# Altium schematic sheet NOR Flash.SchDoc
size A; SheetNumber: 4; SheetTotal: 9
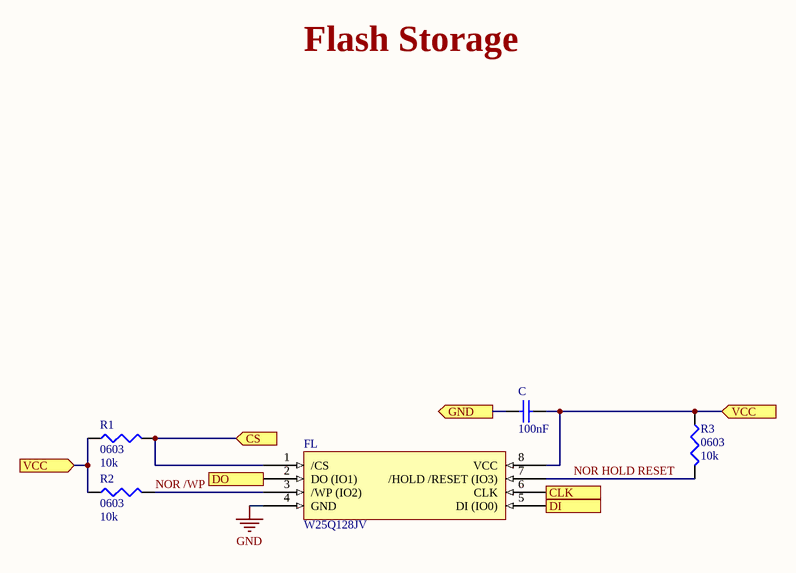
[diagram p0: NOR Flash.SchDoc]

## Parts
C  100nF  [CAPC1608X95X40ML15T15]
FL  omponent_1  [SOIC-8 - duplicate]  (value not drawn)
R1  0603  value 10k  [J1-0603]
R2  0603  value 10k  [J1-0603]
R3  0603  value 10k  [J1-0603]

## Ports
CLK (in), CS (in), DI (in), DO (out), GND (out), VCC (in)

## Nets
GND: FL.4(GND)
CLK: FL.6(CLK) ; port CLK
CS: FL.1(/CS) R1.2 ; port CS
DI: FL.5(DI_(IO0)) ; port DI
DO: FL.2(DO_(IO1)) ; port DO
GND: C.2 ; port GND  [a separate net that carries the same name]
NOR /WP: FL.3(/WP_(IO2)) R2.2
NOR HOLD RESET: FL.7(/HOLD_/RESET_(IO3)) R3.2
VCC: C.1 FL.8(VCC) R1.1 R2.1 R3.1 ; port VCC

## Notes on the sheet
- Flash Storage
- (in symbol Component_1) W25Q128JV

## Library data of the parts
C = CMP-2006-01550-1: Manufacturer: Vitramon; Part Number: VJ0603Y104KXQCW1BC
FL = Component_1
R1-R3 = Res3: Resistor; Published: 8-Jun-2000; LatestRevisionDate: 29-May-2009; LatestRevisionNote: IPC-7351 Footprint Added.; PackageReference: J1-0603; Publisher: Altium Limited; PackageDescription: Chip Resistor